# EAGLE design eeprom adaptor (EAGLE 9.6.2)
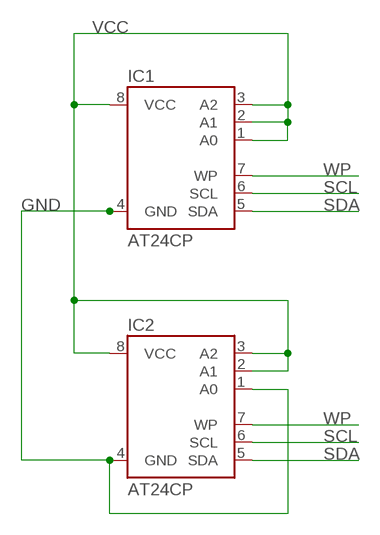
[diagram p0: schematic, sheet 1]

## Parts
IC1  AT24CP  [DIL08]
IC2  AT24CP  [DIL08]

## Nets
GND: IC1.4(GND) IC2.1(A0) IC2.4(GND)
SCL: IC1.6(SCL) IC2.6(SCL)
SDA: IC1.5(SDA) IC2.5(SDA)
VCC: IC1.1(A0) IC1.2(A1) IC1.3(A2) IC1.8(VCC) IC2.2(A1) IC2.3(A2) IC2.8(VCC)
WP: IC1.7(WP) IC2.7(WP)

## Library data of the parts
IC1 IC2 = atmel:AT24C*: 2-wire serial EEPROM; MPN: AT24C1024BW-SH-B; OC_FARNELL: 1362646; OC_NEWARK: 03P2044

## Board
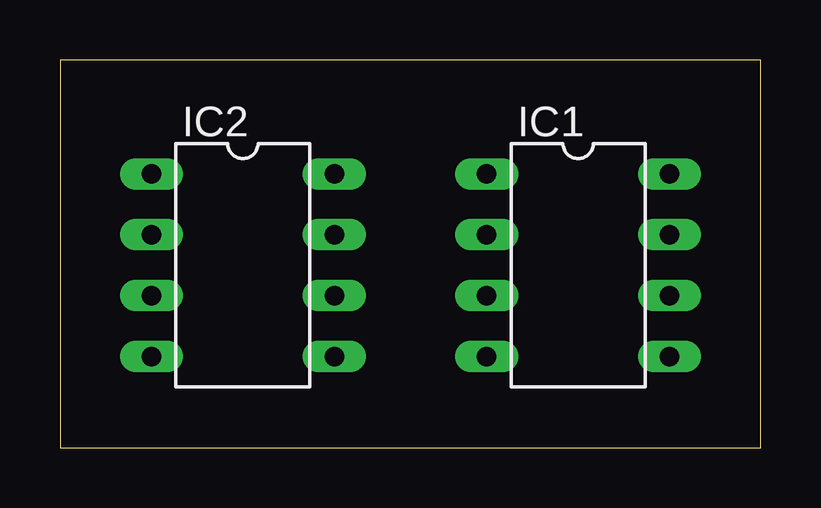
[diagram p1: board, top side]
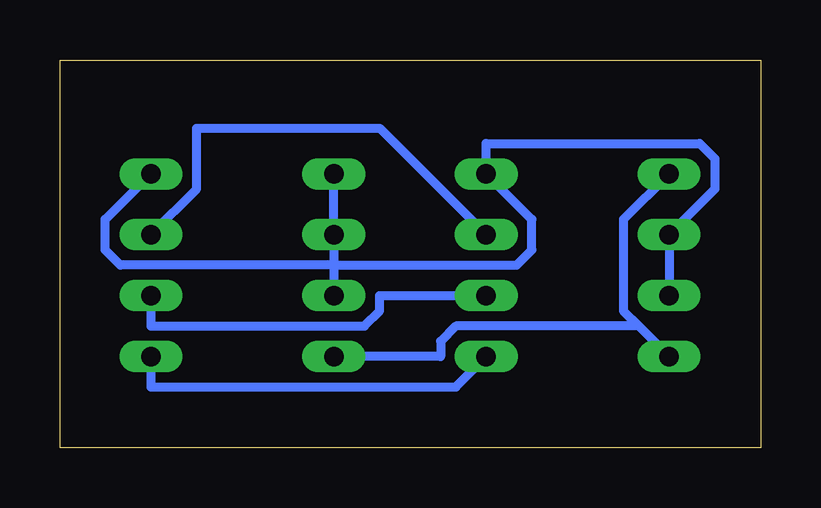
[diagram p2: board, bottom side, seen from below]

Size 29.19 x 16.18 mm. Coordinates in mm from the lower left corner, seen from the top.
Outline: 0,0 29.19,0 29.19,16.18 0,16.18 0,0
Copper layers (1*16): Top 0.035mm / dielectric 0.15mm / Bottom 0.035mm
Design rules "default *": minimum track width 15mil, minimum drill 0.35mm, track to track 20mil, track to pad 15mil, pad to pad 6mil, via to via 6mil, smd to smd 6mil, copper to edge 40mil, drill to drill 6mil, minimum pad ring 10mil, minimum via ring 8mil, stop-mask expansion 4mil, vias tented up to drill 0mil, thermal gap 10mil

### Footprints (pad centres in the part's own frame; a part is rotated, then mirrored left to right if it is on the bottom)
DIL08 = drill 0.813 long: 1 -3.81,-3.81; 2 -1.27,-3.81; 3 1.27,-3.81; 4 3.81,-3.81; 5 3.81,3.81; 6 1.27,3.81; 7 -1.27,3.81; 8 -3.81,3.81

### Placement (x,y rotation side)
IC1  21.59,7.62 270 top
IC2  7.62,7.62 270 top

### Tracks (layer width: path | path; a pad name or v marks a point on that pad's centre or on a via)
GND
  Bottom 0.381: 5.08,5.08 5.71,5.71 5.71,9.53 IC2.1 | 5.08,5.08 IC2.4 | IC1.4 13.33,3.81 13.33,4.45 12.7,5.08 5.08,5.08
SCL
  Bottom 0.381: IC2.6 15.87,6.35 15.87,5.71 16.51,5.08 25.4,5.08 IC1.6
SDA
  Bottom 0.381: IC2.5 12.7,2.54 25.4,2.54 IC1.5
VCC
  Bottom 0.381: IC2.3 IC2.2 1.91,10.79 1.91,12.06 2.54,12.7 11.43,12.7 IC2.8 9.53,9.53 9.53,8.26 10.16,7.62 17.78,7.62 | 17.78,7.62 IC1.2 IC1.1 | 17.78,7.62 IC1.3 | IC1.8 27.3,9.53 27.3,8.26 26.67,7.62 17.78,7.62
WP
  Bottom 0.381: IC2.7 15.87,13.34 23.49,13.34 23.49,10.79 IC1.7